# Altium schematic sheet Current_check.SchDoc
size A; SheetNumber: 2; SheetTotal: 4
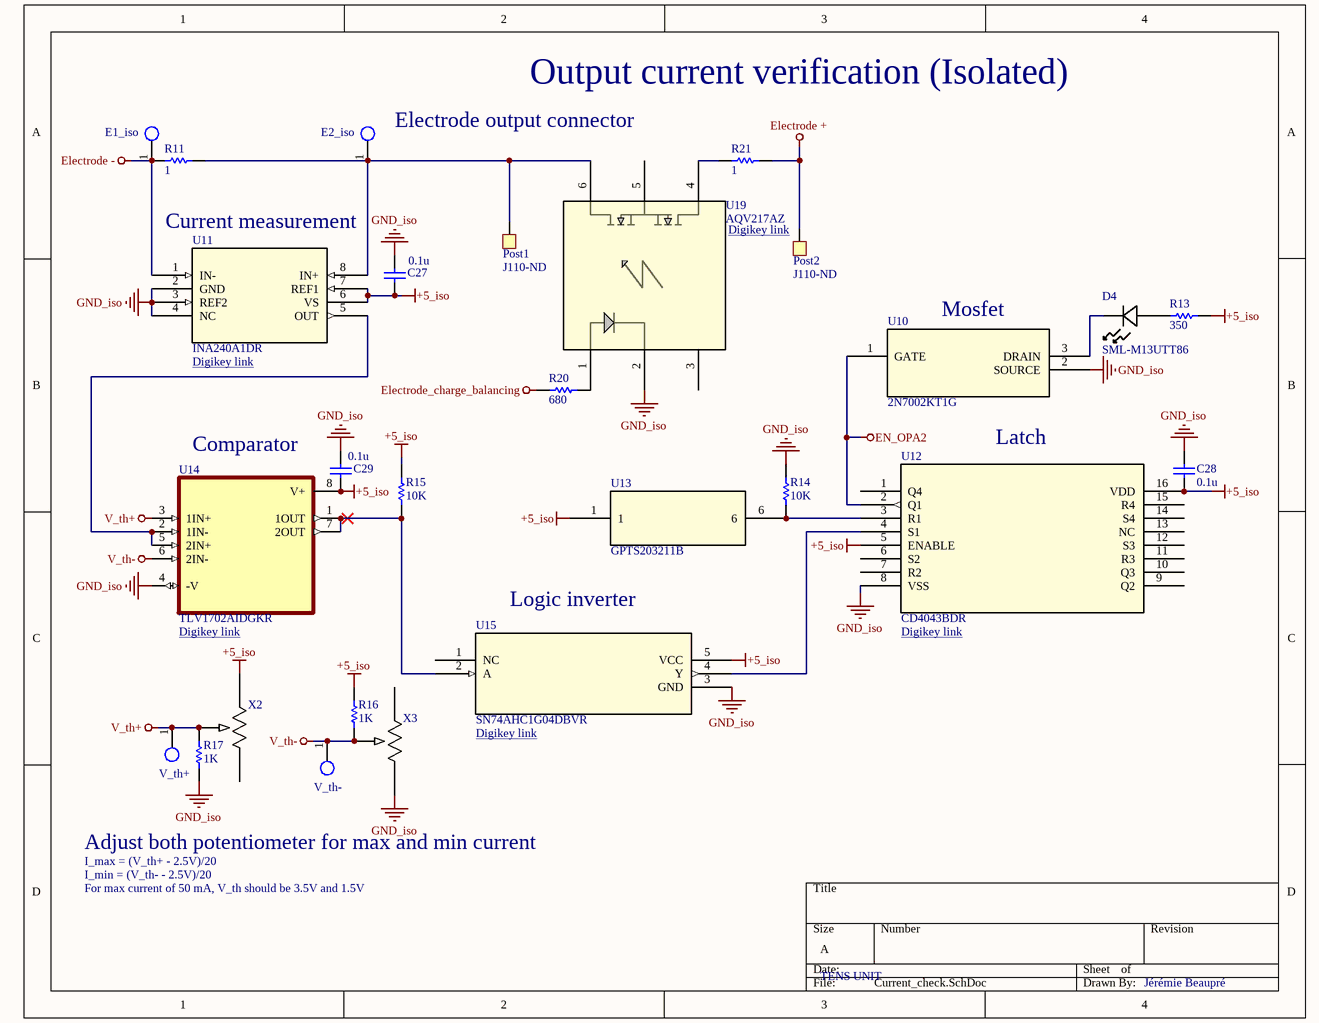
[diagram p0: Current_check.SchDoc]

## Parts
C27  value 0.1u  [CAPC2012X150N]  (hidden comment: Capacitor)
C28  value 0.1u  [CAPC2012X150N]  (hidden comment: Capacitor)
C29  value 0.1u  [CAPC2012X150N]  (hidden comment: Capacitor)
D4  SML-M13UTT86  [LED_SML-M13DT_ROM]
E1_iso  Testpoint_1  [Testpoint1]  (value not drawn)  (no BOM)
E2_iso  Testpoint_1  [Testpoint1]  (value not drawn)  (no BOM)
Post1  J110-ND  [J110-ND]
Post2  J110-ND  [J110-ND]
R11  value 1  [Resistor_0805-M]  (hidden comment: Resistor)
R13  value 350  [Resistor_0805-M]  (hidden comment: Resistor)
R14  value 10K  [Resistor_0805-M]  (hidden comment: Resistor)
R15  value 10K  [Resistor_0805-M]  (hidden comment: Resistor)
R16  value 1K  [Resistor_0805-M]  (hidden comment: Resistor)
R17  value 1K  [Resistor_0805-M]  (hidden comment: Resistor)
R20  value 680  [Resistor_0805-M]  (hidden comment: Resistor)
R21  value 1  [Resistor_0805-M]  (hidden comment: Resistor)
U10  2N7002KT1G  [SOT-23_ONS]
U11  INA240A1DR  [D8_TEX]
U12  CD4043BDR  [D16]
U13  GPTS203211B  [SWITCH_03211B]
U14  TLV1702AIDGKR  [SOP65P490X110-8N]
U15  SN74AHC1G04DBVR  [DBV5]
U19  AQV217AZ  [DIP-6_SMD_PAN]
V_th+  Testpoint_1  [Testpoint1]  (value not drawn)  (no BOM)
V_th-  Testpoint_1  [Testpoint1]  (value not drawn)  (no BOM)
X2  PV36W102C01B00  [POT_PV36W_MUR]  (value not drawn)
X3  PV36W102C01B00  [POT_PV36W_MUR]  (value not drawn)

## Nets
+5_iso: C27.2 C28.2 C29.2 R13.2 R15.2 R16.2 U11.6(VS) U11.7(REF1) U12.5(ENABLE) U12.16(VDD) U13.1 U14.8(V+) U15.5(VCC) X2.3
Electrode +: Post2.1 R21.1
Electrode -: E1_iso.1(P1) R11.1 U11.1(IN-)
Electrode_charge_balancing: R20.2
EN_OPA2: U10.1(GATE) U12.2(Q1)
GND_iso: C27.1 C28.1 C29.1 R14.2 R17.1 U10.2(SOURCE) U11.2(GND) U11.3(REF2) U11.4(NC) U12.8(VSS) U14.4(-V) U15.3(GND) U19.2 X3.1
V_th+: R17.2 U14.3(1IN+) V_th+.1(P1) X2.2
V_th-: R16.1 U14.6(2IN-) V_th-.1(P1) X3.2
NetD4_1: D4.1 U10.3(DRAIN)
NetD4_2: D4.2 R13.1
NetE2_iso_1: E2_iso.1(P1) Post1.1 R11.2 U11.8(IN+) U19.6
NetR14_1: R14.1 U12.3(R1) U13.6
NetR15_1: R15.1 U14.1(1OUT) U14.7(2OUT) U15.2(A)
NetR20_1: R20.1 U19.1
NetR21_2: R21.2 U19.4
NetU11_5: U11.5(OUT) U14.2(1IN-) U14.5(2IN+)
NetU12_4: U12.4(S1) U15.4(Y)

Not connected (* = marked no-connect by the designer): U12 1(Q4) 6(S2) 7(R2) 9(Q2) 10(Q3) 11(R3) 12(S3) 13(NC) 14(S4) 15(R4); U15 1(NC); U19 3(5) 5(4); X2 1; X3 3

## Notes on the sheet
- Output current verification (Isolated)
- (near E2_iso) Electrode output connector
- Current measurement
- (near Post2) Digikey link <https://www.digikey.ca/en/products/detail/panasonic-industry/AQV217AZ/646090?s=N4IgTCBcDaIIIEUBqYCMB2OAtEBdAvkA>
- (near U11) Digikey link <https://www.digikey.ca/en/products/detail/texas-instruments/INA240A1DR/8538109?_gl=1*1puq8vm*_up*MQ..*_gs*MQ..&gclid=Cj0KCQjwm8bTBhDWARIsAC9Hi8lZmiOB0El9-E_6c1ow4nDcjeTHfbqA0Lnjgy8U8yTUWBJwg5PWeQ0aAiB7EALw_wcB&gclsrc=aw.ds&gbraid=0AAAAADrbLlh2Yqokbm2Ifr7gOHjBvqx8v>
- (near U10) Mosfet
- Comparator
- Latch
- Digikey link <https://www.digikey.ca/en/products/detail/texas-instruments/TLV1702AIDGKR/4555458?_gl=1*2ig6y2*_up*MQ..*_gs*MQ..&gclid=Cj0KCQjwm8bTBhDWARIsAC9Hi8lZmiOB0El9-E_6c1ow4nDcjeTHfbqA0Lnjgy8U8yTUWBJwg5PWeQ0aAiB7EALw_wcB&gclsrc=aw.ds&gbraid=0AAAAADrbLlh2Yqokbm2Ifr7gOHjBvqx8v>
- Logic inverter
- (near U12) Digikey link <https://www.digikey.ca/en/products/detail/texas-instruments/CD4043BDR/1691049?_gl=1*2ig6y2*_up*MQ..*_gs*MQ..&gclid=Cj0KCQjwm8bTBhDWARIsAC9Hi8lZmiOB0El9-E_6c1ow4nDcjeTHfbqA0Lnjgy8U8yTUWBJwg5PWeQ0aAiB7EALw_wcB&gclsrc=aw.ds&gbraid=0AAAAADrbLlh2Yqokbm2Ifr7gOHjBvqx8v>
- (near U15) Digikey link <https://www.digikey.ca/en/products/detail/texas-instruments/SN74AHC1G04DBVR/276733?_gl=1*2ig6y2*_up*MQ..*_gs*MQ..&gclid=Cj0KCQjwm8bTBhDWARIsAC9Hi8lZmiOB0El9-E_6c1ow4nDcjeTHfbqA0Lnjgy8U8yTUWBJwg5PWeQ0aAiB7EALw_wcB&gclsrc=aw.ds&gbraid=0AAAAADrbLlh2Yqokbm2Ifr7gOHjBvqx8v>
- Adjust both potentiometer for max and min current
- I_max = (V_th+ - 2.5V)/20
- I_min = (V_th- - 2.5V)/20
- For max current of 50 mA, V_th should be 3.5V and 1.5V
- TENS UNIT
- Jérémie Beaupré

## Library data of the parts
C27-C29 = Capacitor: SimulationGenericComponent: True
D4 = SML-M13UTT86: No Description Available; Manufacturer_Name: ROHM Semiconductor; Copyright: Copyright (C) 2026 Ultra Librarian. All rights reserved.; Manufacturer_Part_Number: SML-M13UTT86
R11 R13-R17 R20 R21 = Resistor: TC1: 0; SimulationGenericComponent: True; TC2: 0
U10 = 2N7002KT1G: Description; Manufacturer_Name: onsemi; Copyright: Copyright (C) 2026 Ultra Librarian. All rights reserved.; Manufacturer_Part_Number: 2N7002KT1G; RefDes: RefDes; Type: Type
U11 = INA240A1DR: -4 to 80V, bidirectional, ultra-precise current sense amplifier with enhanced PWM rejection 8-SOIC -40 to 125; Manufacturer_Name: Texas Instruments; Copyright: Copyright (C) 2025 Ultra Librarian. All rights reserved.; Manufacturer_Part_Number: INA240A1DR; RefDes: RefDes; Type: Type
U12 = CD4043BDR: CMOS Quad NOR R/S Latch with 3-State Outputs 16-SOIC -55 to 125; Manufacturer_Name: Texas Instruments; Copyright: Copyright (C) 2025 Ultra Librarian. All rights reserved.; Manufacturer_Part_Number: CD4043BDR; RefDes: RefDes; Type: Type
U13 = GPTS203211B: No Description Available; Manufacturer_Name: CW Industries; Copyright: Copyright (C) 2026 Ultra Librarian. All rights reserved.; Manufacturer_Part_Number: GPTS203211B; RefDes: RefDes; Type: Type
U14 = TLV1702AIDGKR: Dual high voltage, low power comparator; MF: Texas Instruments; SnapEDA_Link: https://www.snapeda.com/parts/TLV1702AIDGKR/Texas+Instruments/view-part/?ref=snap; Package: VSSOP-8 Texas Instruments; Value: *; MP: TLV1702AIDGKR; Check_prices: https://www.snapeda.com/parts/TLV1702AIDGKR/Texas+Instruments/view-part/?ref=eda
U15 = SN74AHC1G04DBVR: Single 2-V to 5.5-V inverter 5-SOT-23 -40 to 125; Manufacturer_Name: Texas Instruments; Copyright: Copyright (C) 2026 Ultra Librarian. All rights reserved.; Manufacturer_Part_Number: SN74AHC1G04DBVR; RefDes: RefDes; Type: Type
U19 = AQV217AZ: No Description Available; Manufacturer_Name: Panasonic; Copyright: Copyright (C) 2026 Ultra Librarian. All rights reserved.; Manufacturer_Part_Number: AQV217AZ; RefDes: RefDes; Type: Type
X2 X3 = PV36W102C01B00: No Description Available; Manufacturer_Name: Murata; Copyright: Copyright (C) 2026 Ultra Librarian. All rights reserved.; Manufacturer_Part_Number: PV36W102C01B00